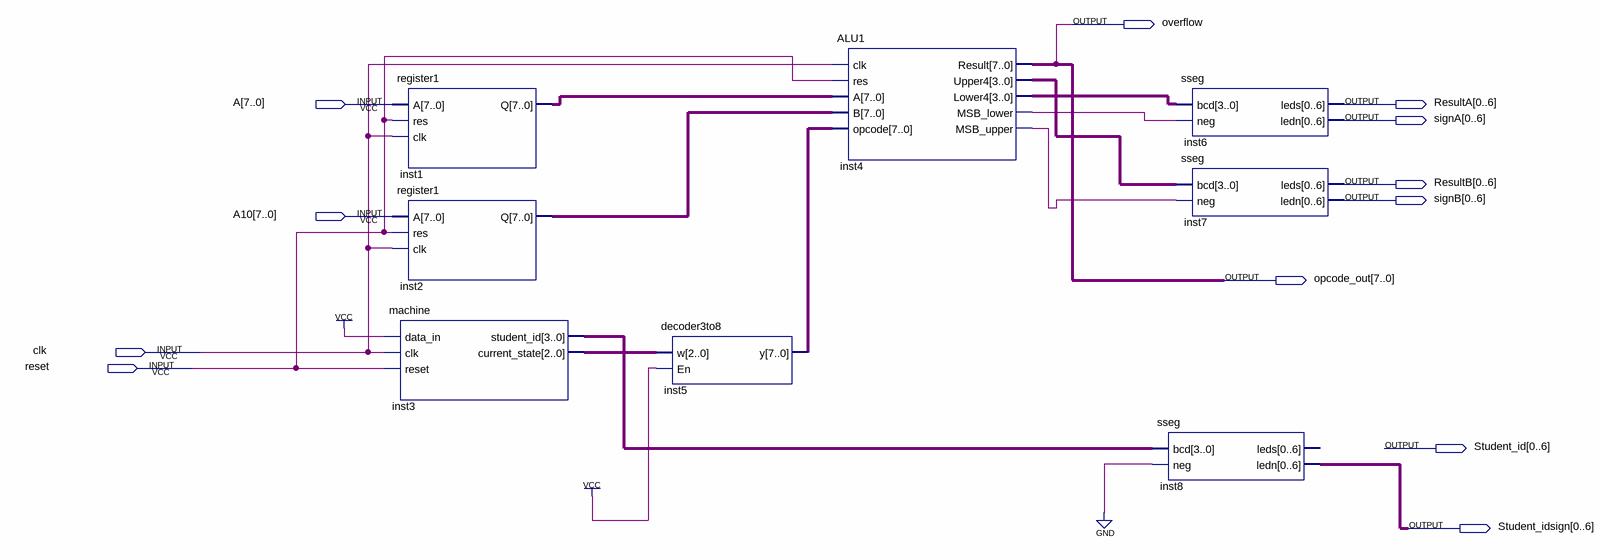
[diagram p0: schematic sheet]
// Quartus schematic partA.bdf as structural Verilog: 8 symbols, 12 pins
module partA (
  input  [7:0] A,
  input  [7:0] A10,
  input  clk,
  input  reset,
  output overflow,
  output [0:6] ResultA,
  output [0:6] signA,
  output [0:6] ResultB,
  output [0:6] signB,
  output [7:0] opcode_out,
  output [0:6] Student_id,
  output [0:6] Student_idsign
);

  wire inst4_msb_lower, inst4_msb_upper;
  wire [2:0] inst3_current_state;
  wire [3:0] inst3_student_id, inst4_lower4, inst4_upper4;
  wire [7:0] inst1_q, inst2_q, inst5_y;

  register1 inst1 (.res(reset), .clk(clk), .Q(inst1_q));  // open: A
  register1 inst2 (.res(reset), .clk(clk), .Q(inst2_q));  // open: A
  machine inst3 (
    .data_in(1'b1), .clk(clk), .reset(reset), .student_id(inst3_student_id),
    .current_state(inst3_current_state));
  decoder3to8 inst5 (.w(inst3_current_state), .En(1'b1), .y(inst5_y));
  ALU1 inst4 (
    .clk(clk), .res(reset), .A(inst1_q), .B(inst2_q), .opcode(inst5_y), .Result(opcode_out),
    .Upper4(inst4_upper4), .Lower4(inst4_lower4), .MSB_lower(inst4_msb_lower), .MSB_upper(inst4_msb_upper));
  sseg inst6 (.bcd(inst4_lower4), .neg(inst4_msb_lower), .leds(ResultA), .ledn(signA));
  sseg inst7 (.bcd(inst4_upper4), .neg(inst4_msb_upper), .leds(ResultB), .ledn(signB));
  sseg inst8 (.bcd(inst3_student_id), .neg(1'b0), .ledn(Student_idsign));  // open: leds
endmodule
